# EAGLE design Shield E_Motion (EAGLE 7.2.0)
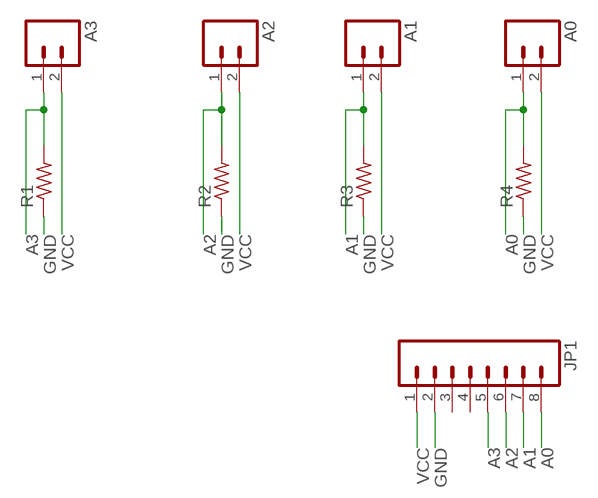
[diagram p0: schematic, sheet 1]

## Parts
A0  M02  [1X02_LONGPADS]
A1  M02  [1X02_LONGPADS]
A2  M02  [1X02_LONGPADS]
A3  M02  [1X02_LONGPADS]
JP1  M08LONGPADS  [1X08_LONGPADS]
R1  RESISTOR0402  [0402]
R2  RESISTOR0402  [0402]
R3  RESISTOR0402  [0402]
R4  RESISTOR0402  [0402]

## Nets
A0: A0.1 JP1.8 R4.2
A1: A1.1 JP1.7 R3.2
A2: A2.1 JP1.6 R2.2
A3: A3.1 JP1.5 R1.2
GND: JP1.2 R1.1 R2.1 R3.1 R4.1
VCC: A0.2 A1.2 A2.2 A3.2 JP1.1
Unconnected: JP1.3 JP1.4

## Library data of the parts
A0 A1-A3 = 01_SparkFun:M02: Header 2 Standard 2-pin 0.1" header. Use with straight break away headers (SKU : PRT-00116), right angle break away headers (PRT-00553), swiss pins (PRT-00743), machine pins (PRT-00117), and female headers (PRT-00115). Molex polarized connector foot print use with SKU : PRT-08233 with associated crimp pins and housings.
JP1 = 01_SparkFun:M08: Header 8 Standard 8-pin 0.1" header. Use with straight break away headers (SKU : PRT-00116), right angle break away headers (PRT-00553), swiss pins (PRT-00743), machine pins (PRT-00117), and female headers (PRT-00115).
R1-R4 = ng:RESISTOR

## Board
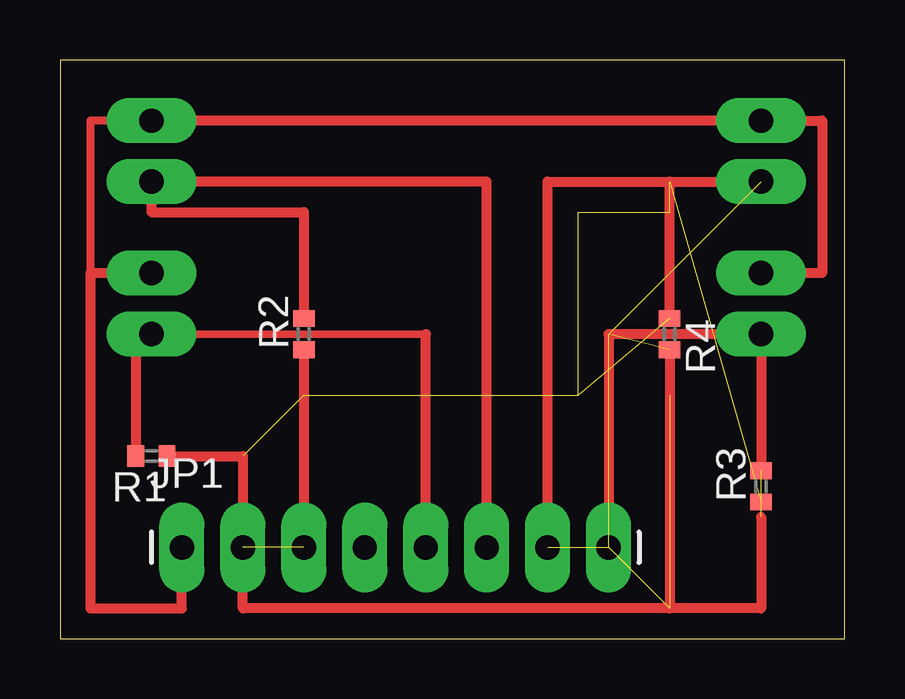
[diagram p1: board, top side]

Size 32.69 x 24.12 mm. Coordinates in mm from the lower left corner, seen from the top.
Outline: 0,0 32.69,0 32.69,24.12 0,24.12 0,0
Copper layers (1*16): Top 0.035mm / dielectric 1.5mm / Bottom 0.035mm
Design rules "default": minimum track width 10mil, minimum drill 24mil, track to track 8mil, track to pad 8mil, pad to pad 8mil, via to via 8mil, smd to smd 8mil, copper to edge 40mil, drill to drill 8mil, minimum pad ring 10mil, minimum via ring 8mil, stop-mask expansion 4mil, vias tented up to drill 0mil, thermal gap 10mil

### Footprints (pad centres in the part's own frame; a part is rotated, then mirrored left to right if it is on the bottom)
1X02_LONGPADS = drill 1.016 pad 1.88 long: 1 0,0; 2 2.54,0
1X08_LONGPADS = drill 1.016 pad 1.88 long: 1 0,0; 2 2.54,0; 3 5.08,0; 4 7.62,0; 5 10.16,0; 6 12.7,0; 7 15.24,0; 8 17.78,0
0402 = smd 0.7 x 0.9: 1 -0.65,0; 2 0.65,0

### Placement (x,y rotation side)
A0  29.21,19.05 90 top
A1  29.21,12.7 90 top
A2  3.81,19.05 90 top
A3  3.81,12.7 90 top
JP1  5.08,3.81 0 top
R1  3.81,7.62 180 top
R2  10.16,12.7 90 top
R3  29.21,6.35 90 top
R4  25.4,12.7 270 top

### Tracks (layer width: path | path; a pad name or v marks a point on that pad's centre or on a via)
A0  (5 unrouted)
  Top 0.406: R4.2 25.4,1.27
A1  (2 unrouted)
  Top 0.406: 7.62,3.81 7.62,1.27 29.21,1.27 29.21,5.08 | JP1.7 20.32,19.05 29.21,19.05 | R3.2 A1.1 22.86,12.7 22.86,3.81
A2
  Top 0.406: JP1.6 17.78,19.05 A2.1 3.81,17.78 10.16,17.78 R2.2
A3
  Top 0.305: 15.24,12.7 A3.1
  Top 0.406: JP1.5 15.24,12.7 | A3.1 3.16,12.7 R1.2
GND  (8 unrouted)
  Top 0.406: JP1.2 7.62,7.62 R1.1 | R4.1 25.4,19.05 | R2.1 10.16,3.81
VCC
  Top 0.33: A2.2 1.27,21.59 1.27,15.24
  Top 0.406: JP1.1 5.08,1.27 1.27,1.27 1.27,15.24 A3.2 | A2.2 A0.2 31.75,21.59 31.75,15.24 A1.2